# Altium schematic sheet Ports.SchDoc
size A4
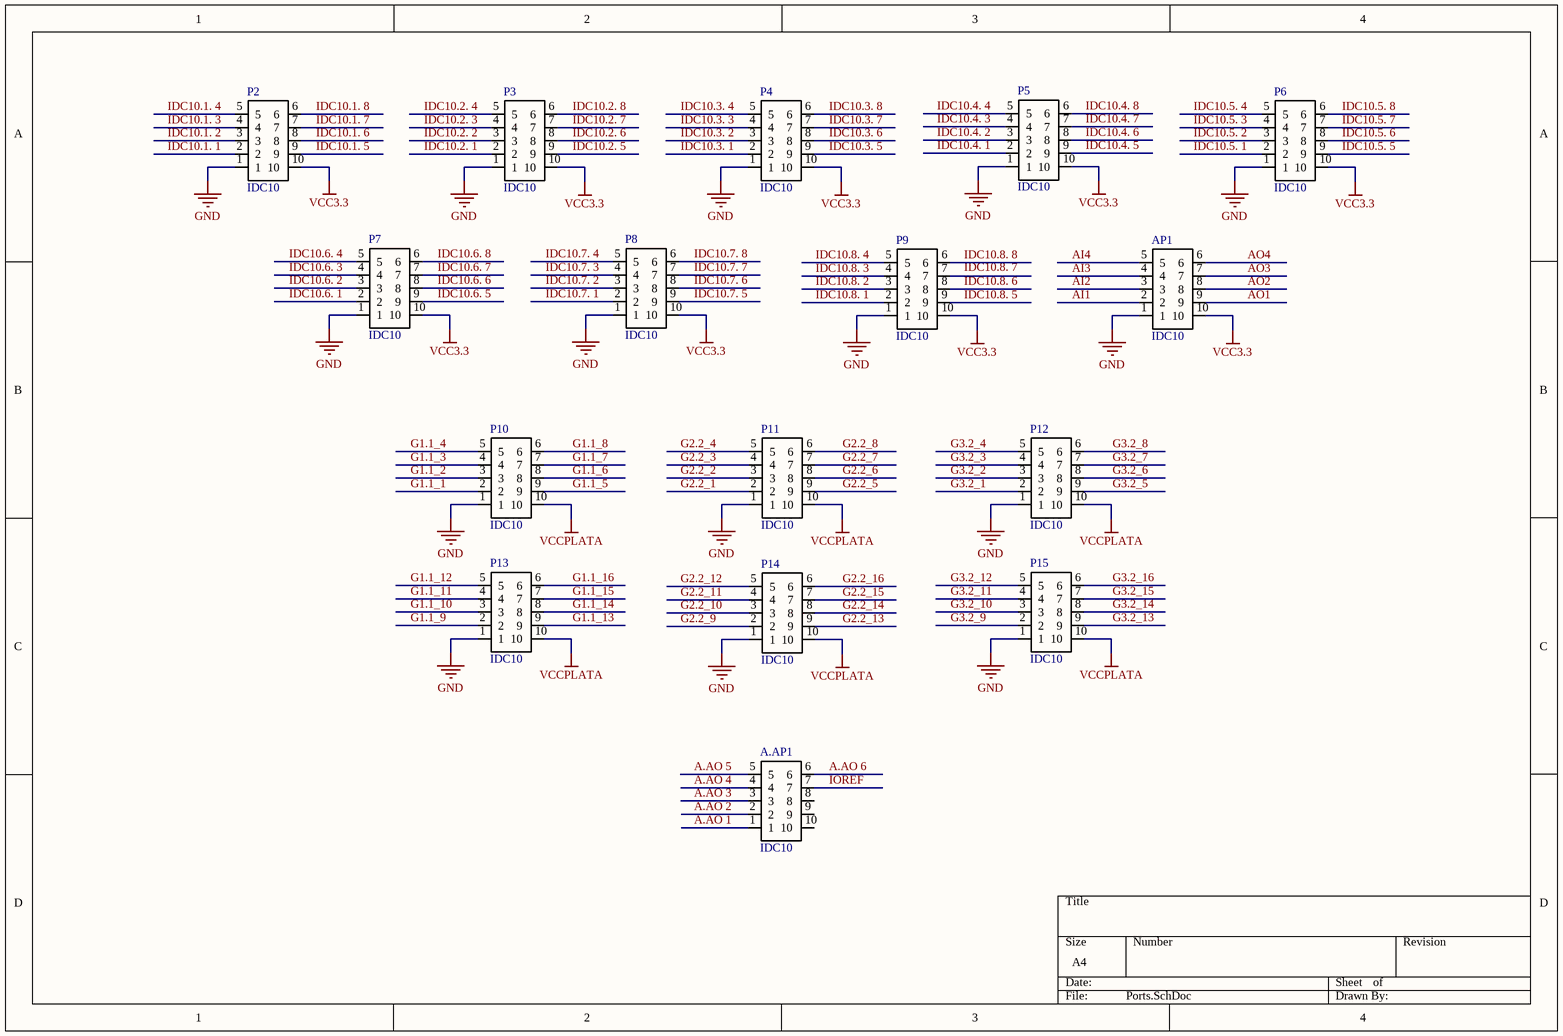
[diagram p0: Ports.SchDoc]

## Parts
A.AP1  IDC10  [IDC10]
AP1  IDC10  [IDC10]
P2  IDC10  [IDC10]
P3  IDC10  [IDC10]
P4  IDC10  [IDC10]
P5  IDC10  [IDC10]
P6  IDC10  [IDC10]
P7  IDC10  [IDC10]
P8  IDC10  [IDC10]
P9  IDC10  [IDC10]
P10  IDC10  [IDC10]
P11  IDC10  [IDC10]
P12  IDC10  [IDC10]
P13  IDC10  [IDC10]
P14  IDC10  [IDC10]
P15  IDC10  [IDC10]

## Nets
GND: AP1.1 P2.1 P3.1 P4.1 P5.1 P6.1 P7.1 P8.1 P9.1 P10.1 P11.1 P12.1 P13.1 P14.1 P15.1
VCC3.3: AP1.10 P2.10 P3.10 P4.10 P5.10 P6.10 P7.10 P8.10 P9.10
VCCPLATA: P10.10 P11.10 P12.10 P13.10 P14.10 P15.10
A.AO 1: A.AP1.1
A.AO 2: A.AP1.2
A.AO 3: A.AP1.3
A.AO 4: A.AP1.4
A.AO 5: A.AP1.5
A.AO 6: A.AP1.6
AI1: AP1.2
AI2: AP1.3
AI3: AP1.4
AI4: AP1.5
AO1: AP1.9
AO2: AP1.8
AO3: AP1.7
AO4: AP1.6
G1.1_1: P10.2
G1.1_2: P10.3
G1.1_3: P10.4
G1.1_4: P10.5
G1.1_5: P10.9
G1.1_6: P10.8
G1.1_7: P10.7
G1.1_8: P10.6
G1.1_9: P13.2
G1.1_10: P13.3
G1.1_11: P13.4
G1.1_12: P13.5
G1.1_13: P13.9
G1.1_14: P13.8
G1.1_15: P13.7
G1.1_16: P13.6
G2.2_1: P11.2
G2.2_2: P11.3
G2.2_3: P11.4
G2.2_4: P11.5
G2.2_5: P11.9
G2.2_6: P11.8
G2.2_7: P11.7
G2.2_8: P11.6
G2.2_9: P14.2
G2.2_10: P14.3
G2.2_11: P14.4
G2.2_12: P14.5
G2.2_13: P14.9
G2.2_14: P14.8
G2.2_15: P14.7
G2.2_16: P14.6
G3.2_1: P12.2
G3.2_2: P12.3
G3.2_3: P12.4
G3.2_4: P12.5
G3.2_5: P12.9
G3.2_6: P12.8
G3.2_7: P12.7
G3.2_8: P12.6
G3.2_9: P15.2
G3.2_10: P15.3
G3.2_11: P15.4
G3.2_12: P15.5
G3.2_13: P15.9
G3.2_14: P15.8
G3.2_15: P15.7
G3.2_16: P15.6
IDC10.1. 1: P2.2
IDC10.1. 2: P2.3
IDC10.1. 3: P2.4
IDC10.1. 4: P2.5
IDC10.1. 5: P2.9
IDC10.1. 6: P2.8
IDC10.1. 7: P2.7
IDC10.1. 8: P2.6
IDC10.2. 1: P3.2
IDC10.2. 2: P3.3
IDC10.2. 3: P3.4
IDC10.2. 4: P3.5
IDC10.2. 5: P3.9
IDC10.2. 6: P3.8
IDC10.2. 7: P3.7
IDC10.2. 8: P3.6
IDC10.3. 1: P4.2
IDC10.3. 2: P4.3
IDC10.3. 3: P4.4
IDC10.3. 4: P4.5
IDC10.3. 5: P4.9
IDC10.3. 6: P4.8
IDC10.3. 7: P4.7
IDC10.3. 8: P4.6
IDC10.4. 1: P5.2
IDC10.4. 2: P5.3
IDC10.4. 3: P5.4
IDC10.4. 4: P5.5
IDC10.4. 5: P5.9
IDC10.4. 6: P5.8
IDC10.4. 7: P5.7
IDC10.4. 8: P5.6
IDC10.5. 1: P6.2
IDC10.5. 2: P6.3
IDC10.5. 3: P6.4
IDC10.5. 4: P6.5
IDC10.5. 5: P6.9
IDC10.5. 6: P6.8
IDC10.5. 7: P6.7
IDC10.5. 8: P6.6
IDC10.6. 1: P7.2
IDC10.6. 2: P7.3
IDC10.6. 3: P7.4
IDC10.6. 4: P7.5
IDC10.6. 5: P7.9
IDC10.6. 6: P7.8
IDC10.6. 7: P7.7
IDC10.6. 8: P7.6
IDC10.7. 1: P8.2
IDC10.7. 2: P8.3
IDC10.7. 3: P8.4
IDC10.7. 4: P8.5
IDC10.7. 5: P8.9
IDC10.7. 6: P8.8
IDC10.7. 7: P8.7
IDC10.7. 8: P8.6
IDC10.8. 1: P9.2
IDC10.8. 2: P9.3
IDC10.8. 3: P9.4
IDC10.8. 4: P9.5
IDC10.8. 5: P9.9
IDC10.8. 6: P9.8
IDC10.8. 8: P9.6
IOREF: A.AP1.7

Not connected (* = marked no-connect by the designer): A.AP1 8 9 10; P9 7

## Notes on the sheet
- Labels drawn without touching a wire or pin: IDC10.8. 7